# Altium schematic sheet wm8960.SchDoc
size A3
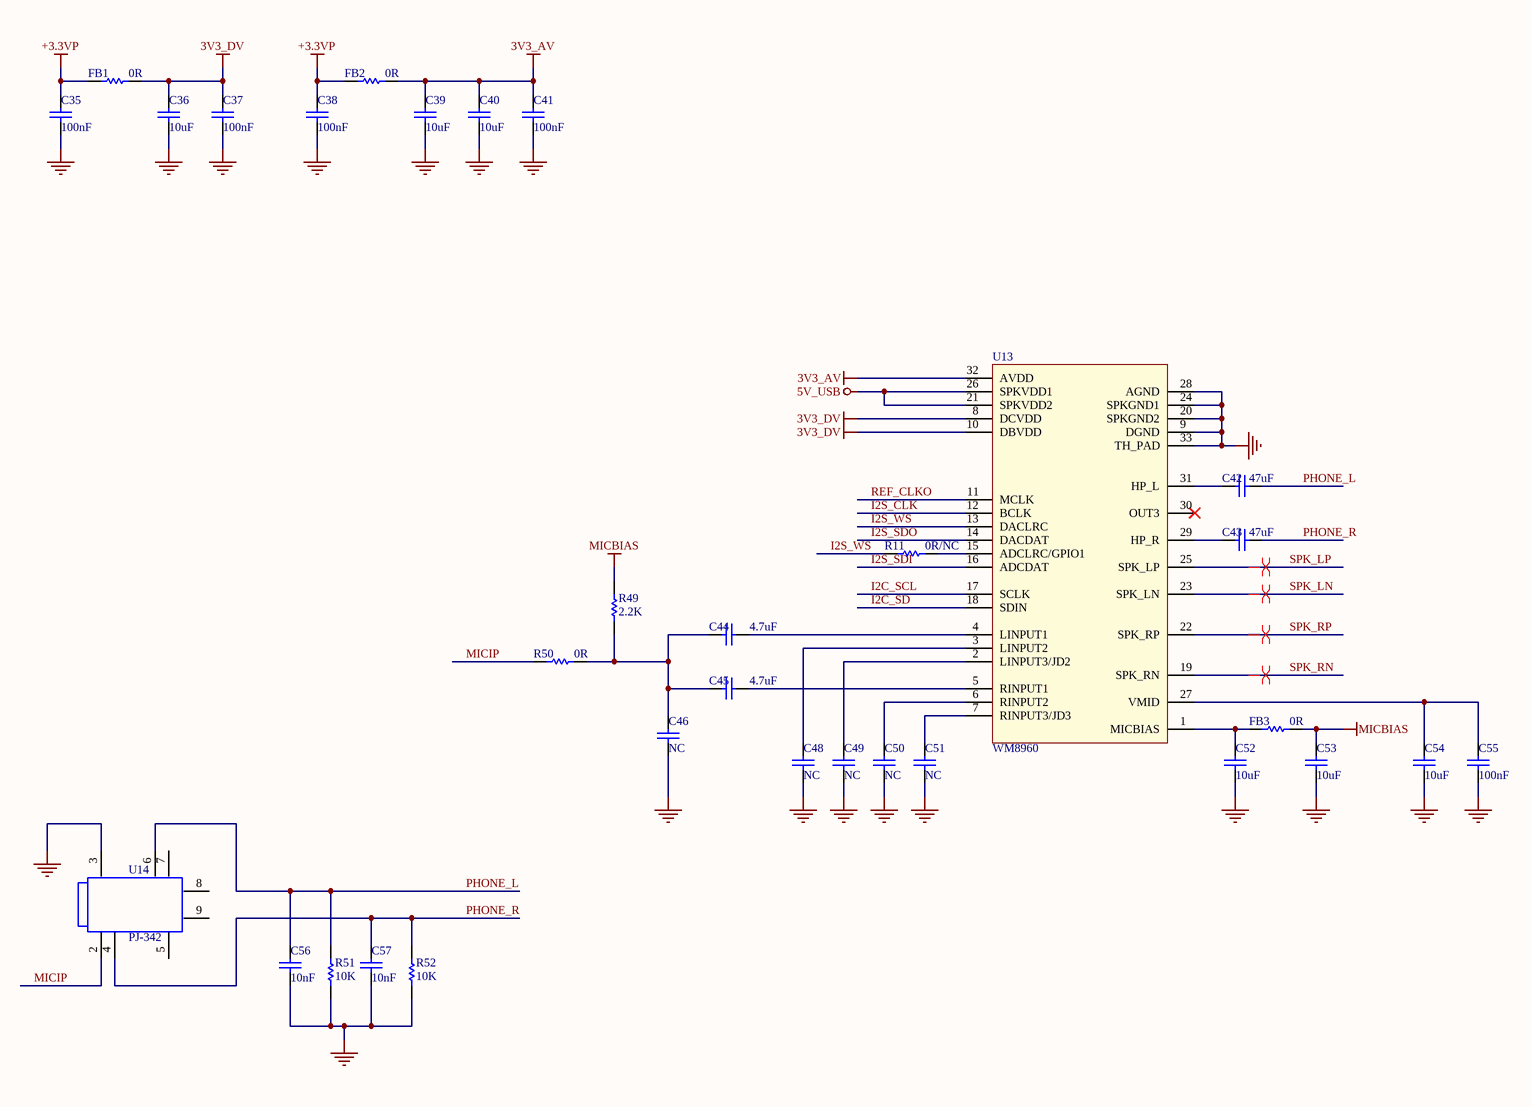
[diagram p0: wm8960.SchDoc]

## Parts
C35  value 100nF  [C0603L]  (hidden comment: Cap Semi)
C36  value 10uF  [C0603L]  (hidden comment: Cap Semi)
C37  value 100nF  [C0603L]  (hidden comment: Cap Semi)
C38  value 100nF  [C0603L]  (hidden comment: Cap Semi)
C39  value 10uF  [C0603L]  (hidden comment: Cap Semi)
C40  value 10uF  [C0603L]  (hidden comment: Cap Semi)
C41  value 100nF  [C0603L]  (hidden comment: Cap Semi)
C42  value 47uF  [C0805L]  (hidden comment: Cap Semi)
C43  value 47uF  [C0805L]  (hidden comment: Cap Semi)
C44  value 4.7uF  [C0603L]  (hidden comment: Cap Semi)
C45  value 4.7uF  [C0603L]  (hidden comment: Cap Semi)
C46  value NC  [C0603L]  (hidden comment: Cap Semi)
C48  value NC  [C0603L]  (hidden comment: Cap Semi)
C49  value NC  [C0603L]  (hidden comment: Cap Semi)
C50  value NC  [C0603L]  (hidden comment: Cap Semi)
C51  value NC  [C0603L]  (hidden comment: Cap Semi)
C52  value 10uF  [C0603L]  (hidden comment: Cap Semi)
C53  value 10uF  [C0603L]  (hidden comment: Cap Semi)
C54  value 10uF  [C0603L]  (hidden comment: Cap Semi)
C55  value 100nF  [C0603L]  (hidden comment: Cap Semi)
C56  value 10nF  [C0603L]  (hidden comment: Cap Semi)
C57  value 10nF  [C0603L]  (hidden comment: Cap Semi)
FB1  value 0R  [R0603L]  (hidden comment: Res Semi)
FB2  value 0R  [R0603L]  (hidden comment: Res Semi)
FB3  value 0R  [R0603L]  (hidden comment: Res Semi)
R11  value 0R/NC  [R0603L]  (hidden comment: Res Semi)
R49  value 2.2K  [R0603L]  (hidden comment: Res Semi)
R50  value 0R  [R0603L]  (hidden comment: Res Semi)
R51  value 10K  [R0603L]  (hidden comment: Res Semi)
R52  value 10K  [R0603L]  (hidden comment: Res Semi)
U13  WM8960  [QFN_32]
U14  PJ-342  [PJ-342_PCB]

## Nets
3V3_AV: C39.1 C40.1 C41.1 FB2.1 U13.32(AVDD)
3V3_DV: C36.1 C37.1 FB1.1 U13.8(DCVDD) U13.10(DBVDD)
5V_USB: U13.21(SPKVDD2) U13.26(SPKVDD1)
+3.3VP: C35.1 C38.1 FB1.2 FB2.2
GND: C35.2 C36.2 C37.2 C38.2 C39.2 C40.2 C41.2 C46.2 C48.2 C49.2 C50.2 C51.2 C52.2 C53.2 C54.2 C55.2 C56.1 C57.1 R51.2 R52.2 U13.9(DGND) U13.20(SPKGND2) U13.24(SPKGND1) U13.28(AGND) U13.33(TH_PAD) U14.3
MICBIAS: C53.1 FB3.1 R49.1
I2C_SCL: U13.17(SCLK)
I2C_SD: U13.18(SDIN)
I2S_CLK: U13.12(BCLK)
I2S_SDI: U13.16(ADCDAT)
I2S_SDO: U13.14(DACDAT)
I2S_WS: R11.2 U13.13(DACLRC)
MICIP: R50.2 U14.2
PHONE_L: C42.2 C56.2 R51.1 U14.6
PHONE_R: C43.2 C57.2 R52.1 U14.4
REF_CLKO: U13.11(MCLK)
SPK_LN: U13.23(SPK_LN)
SPK_LP: U13.25(SPK_LP)
SPK_RN: U13.19(SPK_RN)
SPK_RP: U13.22(SPK_RP)
NetC42_1: C42.1 U13.31(HP_L)
NetC43_1: C43.1 U13.29(HP_R)
NetC44_1: C44.1 C45.1 C46.1 R49.2 R50.1
NetC44_2: C44.2 U13.4(LINPUT1)
NetC45_2: C45.2 U13.5(RINPUT1)
NetC48_1: C48.1 U13.3(LINPUT2)
NetC49_1: C49.1 U13.2(LINPUT3/JD2)
NetC50_1: C50.1 U13.6(RINPUT2)
NetC51_1: C51.1 U13.7(RINPUT3/JD3)
NetC52_1: C52.1 FB3.2 U13.1(MICBIAS)
NetC54_1: C54.1 C55.1 U13.27(VMID)
NetR11_1: R11.1 U13.15(ADCLRC/GPIO1)

Not connected (* = marked no-connect by the designer): U13 30(OUT3)*; U14 5 7 8 9

## Layout directives
differential pair: SPK_LN, SPK_LP, SPK_RN, SPK_RP

## Library data of the parts
C35-C46 C48-C57 = Cap Semi: Capacitor (Semiconductor SIM Model); Published: 8-Jun-2000; LatestRevisionDate: 17-Jul-2002; LatestRevisionNote: Re-released for DXP Platform.; PackageReference: C1206; Publisher: Altium Limited
FB1-FB3 R11 R49-R52 = Res Semi: Semiconductor Resistor; Published: 8-Jun-2000; LatestRevisionDate: 17-Jul-2002; LatestRevisionNote: Re-released for DXP Platform.; PackageReference: AXIAL-0.5; Publisher: Altium Limited